# EAGLE design TDA2004 (EAGLE 7.3.0)
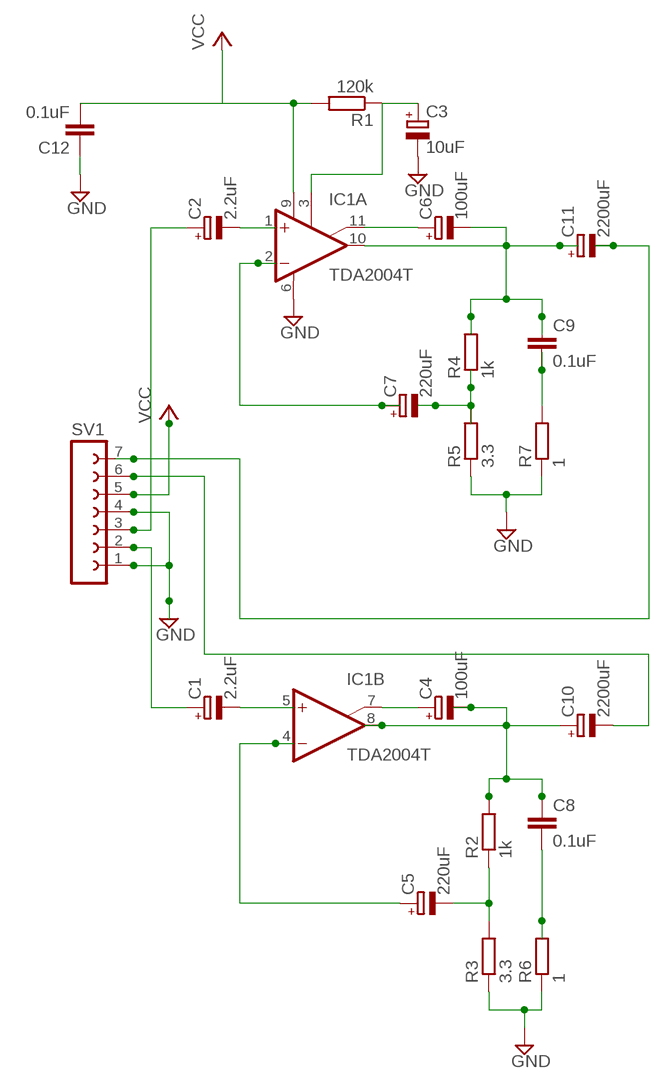
[diagram p0: schematic, sheet 1]

## Parts
C1  2.2uF  CPOL-EUB45181B  [B45181B]
C2  2.2uF  CPOL-EUB45181B  [B45181B]
C3  10uF  CPOL-EUB45181B  [B45181B]
C4  100uF  CPOL-EUE2.5-5  [E2,5-5]
C5  220uF  CPOL-EUB45181B  [B45181B]
C6  100uF  CPOL-EUE2.5-5  [E2,5-5]
C7  220uF  CPOL-EUB45181B  [B45181B]
C8  0.1uF  C-EU025-024X044  [C025-024X044]
C9  0.1uF  C-EU025-024X044  [C025-024X044]
C10  2200uF  CPOL-EUE5-10.5  [E5-10,5]
C11  2200uF  CPOL-EUE5-10.5  [E5-10,5]
C12  0.1uF  C-EU025-024X044  [C025-024X044]
IC1  TDA2004T  [SIP11]
R1  120k  R-EU_0207/10  [0207/10]
R2  1k  R-EU_0207/10  [0207/10]
R3  3.3  R-EU_0207/10  [0207/10]
R4  1k  R-EU_0207/10  [0207/10]
R5  3.3  R-EU_0207/10  [0207/10]
R6  1  R-EU_0207/10  [0207/10]
R7  1  R-EU_0207/10  [0207/10]
SV1  FE07-1  [FE07]

## Nets
GND: C3.- C12.1 IC1.6(A:GND) R3.1 R5.1 R6.1 R7.1 SV1.1 SV1.4
N$1: C3.+ IC1.3(A:SVRR) R1.1
N$2: C9.2 R7.2
N$3: C6.- C9.1 C11.+ IC1.10(A:OUT) R4.2
N$4: C6.+ IC1.11(A:BTSP)
N$5: C2.- IC1.1(A:+IN)
N$6: C7.+ IC1.2(A:-IN)
N$7: C10.- SV1.6
N$8: C4.+ IC1.7(B:BTSP)
N$9: C7.- R4.1 R5.2
N$10: C1.- IC1.5(B:+IN)
N$11: C5.- R2.1 R3.2
N$12: C8.2 R6.2
N$13: C11.- SV1.7
N$14: C5.+ IC1.4(B:-IN)
N$15: C4.- C8.1 C10.+ IC1.8(B:OUT) R2.2
N$16: C1.+ SV1.2
N$17: C2.+ SV1.3
VCC: C12.2 IC1.9(A:V+) R1.2 SV1.5

## Library data of the parts
C1-C7 C10 C11 = rcl:CPOL-EU: POLARIZED CAPACITOR, European symbol
C8 C9 C12 = rcl:C-EU: CAPACITOR, European symbol
IC1 = Audio-Power-amplifier:TDA2004: Power OP AMP
R1-R7 = resistor:R-EU_: RESISTOR, European symbol
SV1 = con-lsta:FE07-1: FEMALE HEADER; OC_FARNELL: unknown; OC_NEWARK: unknown

## Board
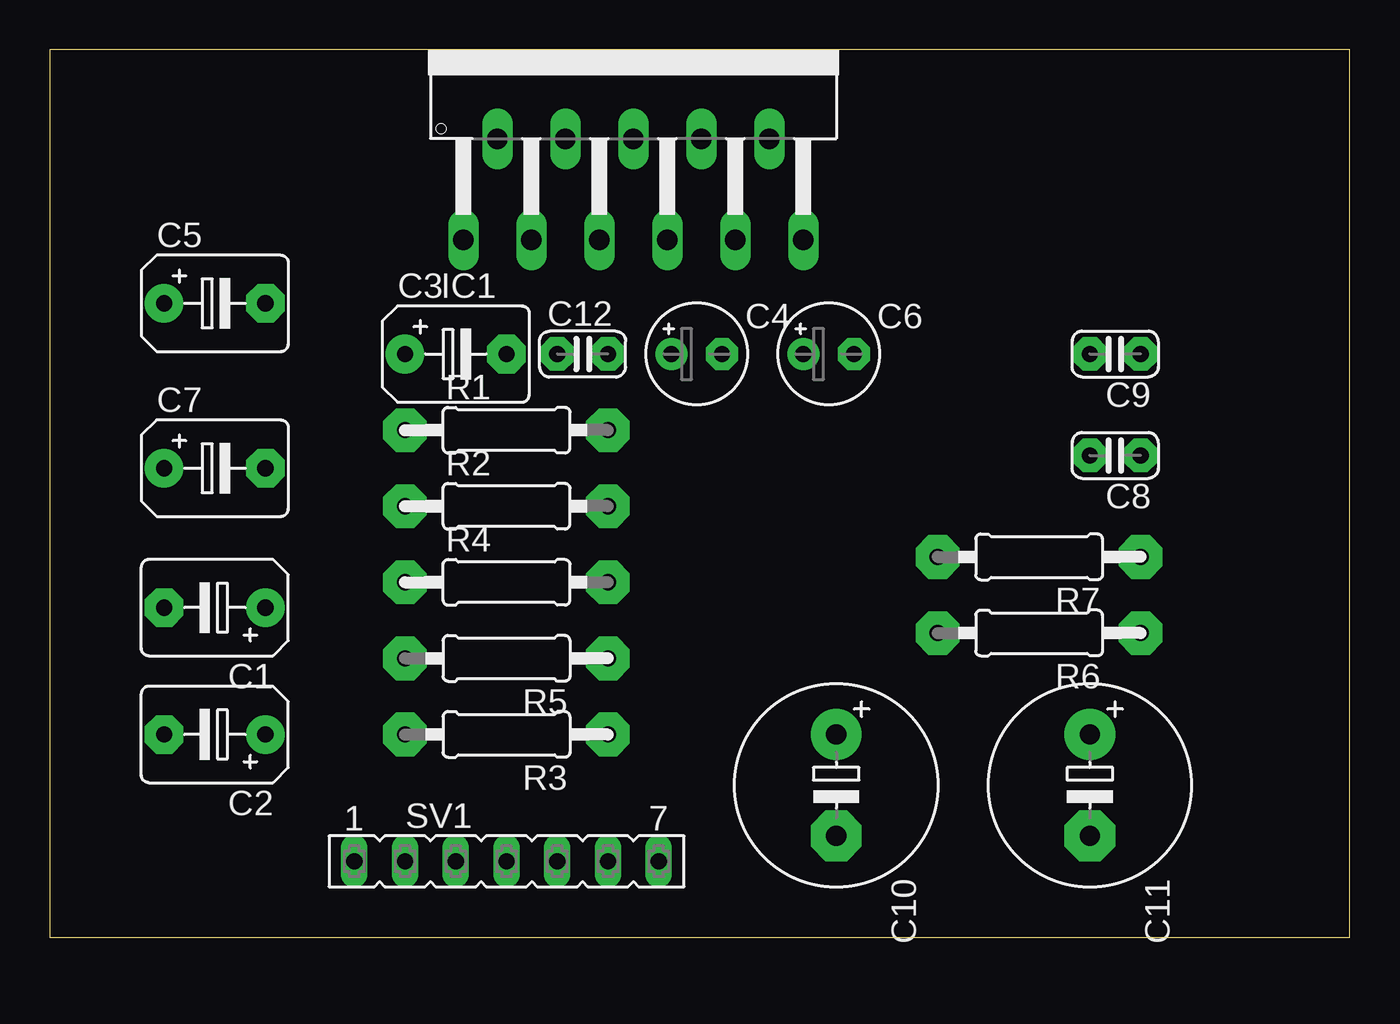
[diagram p1: board, top side]
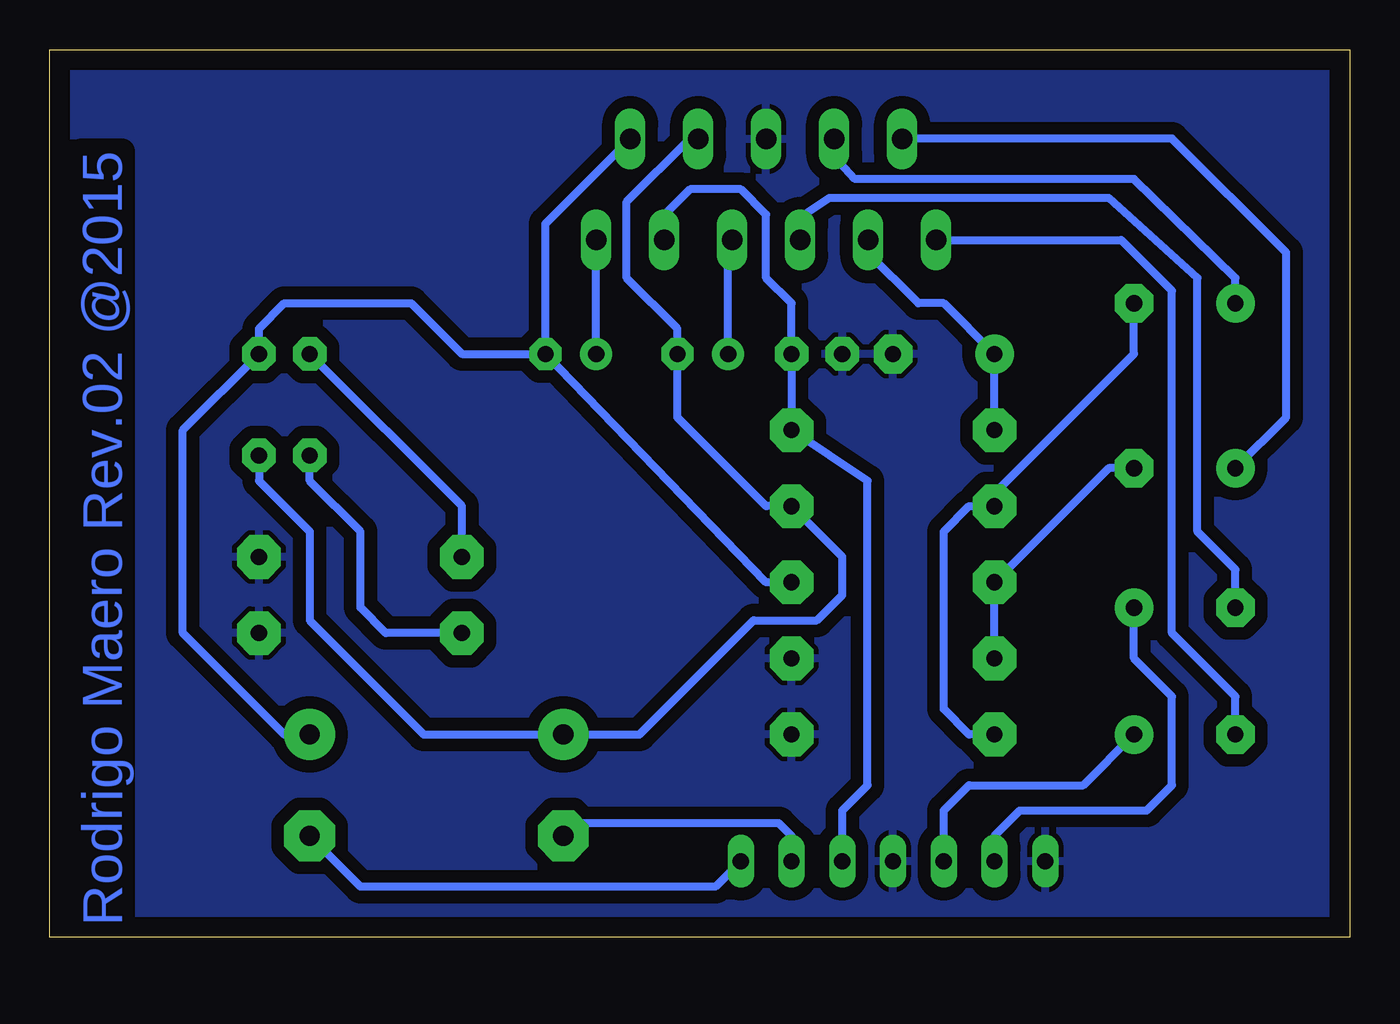
[diagram p2: board, bottom side, seen from below]

Size 65.08 x 44.44 mm. Coordinates in mm from the lower left corner, seen from the top.
Outline: 0,0 65.08,0 65.08,44.44 0,44.44 0,0
Copper layers (1*16): Top 0.035mm / dielectric 1.5mm / Bottom 0.035mm
Design rules "default *": minimum track width 10mil, minimum drill 24mil, track to track 10mil, track to pad 10mil, pad to pad 10mil, via to via 10mil, smd to smd 8mil, copper to edge 40mil, drill to drill 8mil, minimum pad ring 10mil, minimum via ring 8mil, stop-mask expansion 4mil, vias tented up to drill 0mil, thermal gap 10mil

### Footprints (pad centres in the part's own frame; a part is rotated, then mirrored left to right if it is on the bottom)
B45181B = drill 0.813 pad 1.93: + -2.54,0 | drill 0.813 pad 1.93 octagon: - 2.54,0
E2,5-5 = drill 0.813 pad 1.6: + -1.27,0 | drill 0.813 pad 1.6 octagon: - 1.27,0
C025-024X044 = drill 0.813 pad 1.676 octagon: 1 -1.27,0; 2 1.27,0
E5-10,5 = drill 1.016 pad 2.54: + -2.54,0 | drill 1.016 pad 2.54 octagon: - 2.54,0
SIP11 = drill 1.016 long: 1 -8.509,-9.525; 2 -6.807,-4.47; 3 -5.105,-9.525; 4 -3.404,-4.47; 5 -1.702,-9.525; 6 0,-4.47; 7 1.702,-9.525; 8 3.404,-4.47; 9 5.105,-9.525; 10 6.807,-4.47; 11 8.509,-9.525
0207/10 = drill 0.813 pad 2.184 octagon: 1 -5.08,0; 2 5.08,0
FE07 = drill 0.813 long: 1 -7.62,0; 2 -5.08,0; 3 -2.54,0; 4 0,0; 5 2.54,0; 6 5.08,0; 7 7.62,0

### Placement (x,y rotation side)
C1  8.26,16.51 180 top
C2  8.26,10.16 180 top
C3  20.32,29.21 0 top
C4  32.38,29.21 0 top
C5  8.26,31.75 0 top
C6  38.99,29.21 0 top
C7  8.26,23.5 0 top
C8  53.34,24.13 180 top
C9  53.34,29.21 180 top
C10  39.37,7.62 270 top
C11  52.07,7.62 270 top
C12  26.67,29.21 0 top
IC1  29.21,44.45 0 top
R1  22.86,25.4 0 top
R2  22.86,21.59 0 top
R3  22.86,10.16 180 top
R4  22.86,17.78 0 top
R5  22.86,13.97 180 top
R6  49.53,15.24 180 top
R7  49.53,19.05 180 top
SV1  22.86,3.81 0 top

### Tracks (layer width: path | path; a pad name or v marks a point on that pad's centre or on a via)
GND
  pour Bottom (isolate 0.635): -3.81,46.99 68.58,46.99 68.58,-2.54 -3.81,-2.54
N$1
  Bottom 0.406: R1.1 C3.+ 20.32,31.75 21.59,31.75 24.13,34.29 24.13,34.9 IC1.3
N$2
  Bottom 0.406: R7.2 44.45,21.59 C9.2
N$3
  Bottom 0.406: 36.2,39.8 IC1.10 40.26,35.74 C6.- | R4.2 29.21,17.78 C6.- | C11.+ 53.34,10.16 58.42,15.24 58.42,25.4 C9.1 54.61,30.48 53.34,31.75 46.99,31.75 44.45,29.21 C6.-
N$4
  Bottom 0.406: C6.+ IC1.11
N$5
  Bottom 0.406: IC1.1 11.43,34.92 8.89,32.38 8.89,15.24 5.71,12.06 C2.-
N$6
  Bottom 0.406: C7.+ 3.17,26.04 3.17,34.29 8.89,40.01 22.38,40.01 IC1.2
N$7
  Bottom 0.406: SV1.6 27.94,5.08 28.57,5.71 38.73,5.71 C10.-
N$8
  Bottom 0.406: C4.+ 31.11,34.72 IC1.7
N$9
  Bottom 0.406: R5.2 R4.1 12.06,23.5 C7.-
N$10
  Bottom 0.406: C1.- 5.71,18.41 7.62,20.32 7.62,33.02 12.06,37.02 26.04,37.02 27.3,36.2 27.3,35.13 IC1.5
N$11
  Bottom 0.406: R3.2 19.05,10.16 20.32,11.43 20.32,20.32 19.05,21.59 R2.1 17.78,22.23 10.79,29.21 C5.-
N$12
  Bottom 0.406: R6.2 48.26,15.24 49.53,16.51 49.53,20.32 52.07,22.86 C8.2
N$13
  Bottom 0.406: SV1.7 31.75,2.54 49.53,2.54 C11.-
N$14
  Bottom 0.406: C5.+ 5.71,33.02 10.79,37.97 24.77,37.97 26.04,39.37 26.04,39.75 IC1.4
N$15
  Bottom 0.406: IC1.8 32.64,40.01 33.02,40.01 36.2,36.83 36.2,33.02 33.66,30.48 C4.- 33.66,26.04 29.21,21.59 R2.2 25.4,19.05 25.4,17.14 26.67,15.88 29.84,15.88 35.56,10.16 C10.+ 46.35,10.16 52.07,15.88 52.07,20.32 54.61,22.86 C8.1
N$16
  Bottom 0.406: SV1.2 17.78,5.08 16.51,6.35 10.16,6.35 8.89,7.62 8.89,12.06 10.79,13.97 C1.+
N$17
  Bottom 0.406: SV1.3 20.32,6.35 19.05,7.62 13.34,7.62 C2.+
VCC
  Bottom 0.406: SV1.5 25.4,6.35 24.13,7.62 24.13,22.86 R1.2 C12.2 27.94,31.75 29.21,33.02 29.21,36.2 30.48,37.47 33.02,37.47 34.29,36.2 34.29,34.95 IC1.9

### Text on the board
Bottom: Rodrigo Maero Rev.02 @2015